# EAGLE design RAC-tracker (EAGLE 9.5.2)
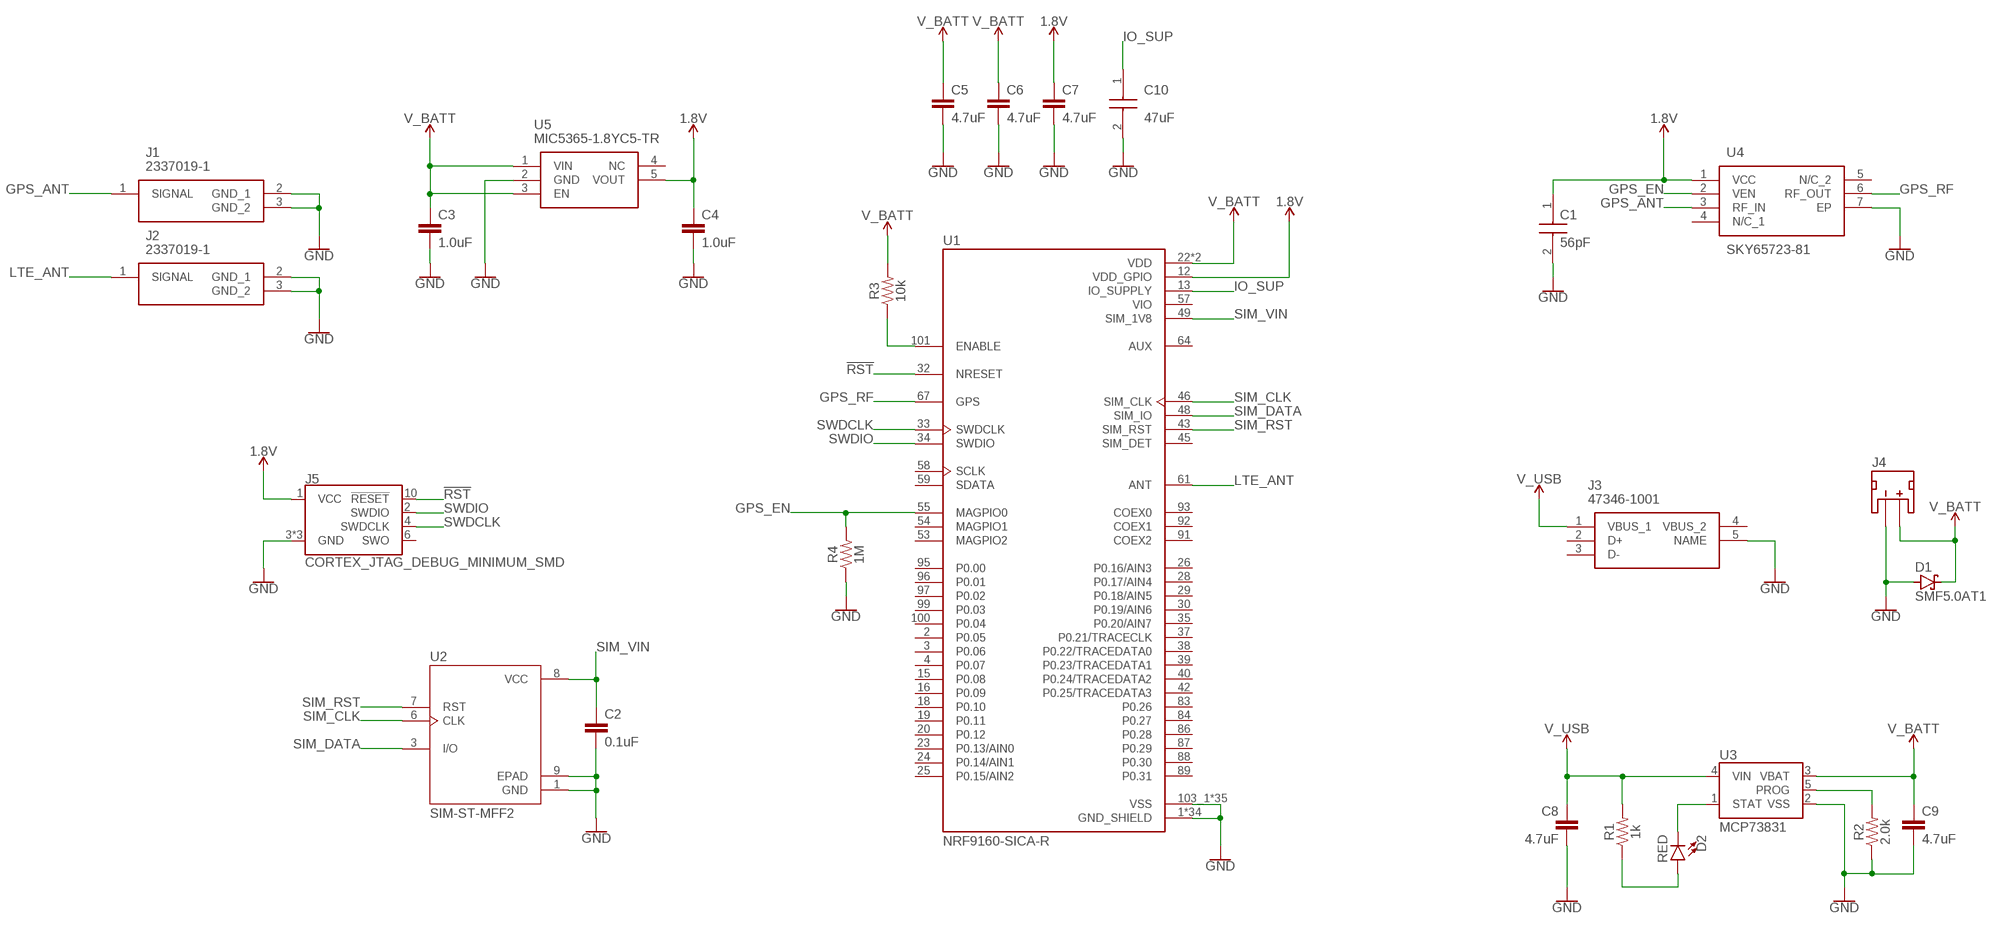
[diagram p0: schematic, sheet 1]

## Parts
C1  56pF  GRM1885C1H560JA01J  [CAPC1608X90N]
C2  0.1uF  0.1UF-0603-25V-(+80/-20%)  [0603]
C3  1.0uF  1.0UF-0603-16V-10%  [0603]
C4  1.0uF  1.0UF-0603-16V-10%  [0603]
C5  4.7uF  4.7UF0603  [0603]
C6  4.7uF  4.7UF0603  [0603]
C7  4.7uF  4.7UF0603  [0603]
C8  4.7uF  4.7UF0603  [0603]
C9  4.7uF  4.7UF0603  [0603]
C10  47uF  JMK212BBJ476MG-T  [CAPC2012X145N]
D1  SMF5.0AT1  [SOD123FL]
D2  RED  LED-RED0603  [LED-0603]
J1  2337019-1  [23370191]
J2  2337019-1  [23370191]
J3  47346-1001  [47346-0001]
J4  JST_2MM_MALE  [JST-2-SMD]
J5  CORTEX_JTAG_DEBUG_MINIMUM_SMD  [2X5-SMD-1.27MM]
R1  1k  1KOHM-0603-1/10W-1%  [0603]
R2  2.0k  2.0KOHM-0603-1/10W-5%  [0603]
R3  10k  10KOHM-0603-1/10W-1%  [0603]
R4  1M  1MOHM-0603-1/4W-5%  [0603]
U1  NRF9160-SICA-R  [NORDIC_NRF9160-SICA-R]
U2  SIM-ST-MFF2  [PSON127P500X600X82-9N]
U3  MCP73831  [SOT23-5]
U4  SKY65723-81  [SKY6572381]
U5  MIC5365-1.8YC5-TR  [SOT65P210X110-5N]

## Nets
1.8V: C1.1 C4.1 C7.1 J5.1(VCC) U1.12(VDD_GPIO) U4.1(VCC) U5.5(VOUT)
!RST: J5.10(!RESET) U1.32(NRESET)
EN: R3.1 U1.101(ENABLE)
GND: C1.2 C2.2 C3.2 C4.2 C5.2 C6.2 C7.2 C8.2 C9.2 C10.2 D1.A J1.2(GND_1) J1.3(GND_2) J2.2(GND_1) J2.3(GND_2) J3.5(NAME) J4.1(-) J5.3(GND) J5.5(GND) J5.9(GND) R2.1 R4.1 U1.1(GND_SHIELD) U1.5(GND_SHIELD) U1.9(GND_SHIELD) U1.14(GND_SHIELD) U1.17(GND_SHIELD) U1.21(GND_SHIELD) U1.27(GND_SHIELD) U1.31(GND_SHIELD) U1.36(GND_SHIELD) U1.41(GND_SHIELD) U1.44(GND_SHIELD) U1.47(GND_SHIELD) U1.50(GND_SHIELD) U1.52(GND_SHIELD) U1.56(GND_SHIELD) U1.60(GND_SHIELD) U1.62(GND_SHIELD) U1.63(GND_SHIELD) U1.65(GND_SHIELD) U1.66(GND_SHIELD) U1.72(GND_SHIELD) U1.74(GND_SHIELD) U1.75(GND_SHIELD) U1.76(GND_SHIELD) U1.77(GND_SHIELD) U1.78(GND_SHIELD) U1.79(GND_SHIELD) U1.80(GND_SHIELD) U1.81(GND_SHIELD) U1.82(GND_SHIELD) U1.85(GND_SHIELD) U1.90(GND_SHIELD) U1.94(GND_SHIELD) U1.98(GND_SHIELD) U1.103_1(VSS) U1.103_2(VSS) U1.103_3(VSS) U1.103_4(VSS) U1.103_5(VSS) U1.103_6(VSS) U1.103_7(VSS) U1.103_8(VSS) U1.103_9(VSS) U1.103_10(VSS) U1.103_11(VSS) U1.103_12(VSS) U1.103_13(VSS) U1.103_14(VSS) U1.103_15(VSS) U1.103_16(VSS) U1.103_17(VSS) U1.103_18(VSS) U1.103_19(VSS) U1.103_20(VSS) U1.103_21(VSS) U1.103_22(VSS) U1.103_23(VSS) U1.103_24(VSS) U1.103_25(VSS) U1.103_26(VSS) U1.103_27(VSS) U1.103_28(VSS) U1.103_29(VSS) U1.103_30(VSS) U1.103_31(VSS) U1.103_32(VSS) U1.103_33(VSS) U1.103_34(VSS) U1.103_35(VSS) U2.1(GND) U2.9(EPAD) U3.2(VSS) U4.7(EP) U5.2(GND)
GPS_ANT: J1.1(SIGNAL) U4.3(RF_IN)
GPS_EN: R4.2 U1.55(MAGPIO0) U4.2(VEN)
GPS_RF: U1.67(GPS) U4.6(RF_OUT)
IO_SUP: C10.1 U1.13(IO_SUPPLY)
LTE_ANT: J2.1(SIGNAL) U1.61(ANT)
PROG: R2.2 U3.5(PROG)
SIM_CLK: U1.46(SIM_CLK) U2.6(CLK)
SIM_DATA: U1.48(SIM_IO) U2.3(I/O)
SIM_RST: U1.43(SIM_RST) U2.7(RST)
SIM_VIN: C2.1 U1.49(SIM_1V8) U2.8(VCC)
STAT: D2.C U3.1(STAT)
STAT_AN: D2.A R1.1
SWDCLK: J5.4(SWDCLK) U1.33(SWDCLK)
SWDIO: J5.2(SWDIO) U1.34(SWDIO)
V_BATT: C3.1 C5.1 C6.1 C9.1 D1.C J4.2(+) R3.2 U1.22(VDD) U1.102(VDD) U3.3(VBAT) U5.1(VIN) U5.3(EN)
V_USB: C8.1 J3.1(VBUS_1) R1.2 U3.4(VIN)
Unconnected: J3.2(D+) J3.3(D-) J3.4(VBUS_2) J4.NC1(PAD1) J4.NC2(PAD2) J5.6(SWO) U1.2(P0.05) U1.3(P0.06) U1.4(P0.07) U1.15(P0.08) U1.16(P0.09) U1.18(P0.10) U1.19(P0.11) U1.20(P0.12) U1.23(P0.13/AIN0) U1.24(P0.14/AIN1) U1.25(P0.15/AIN2) U1.26(P0.16/AIN3) U1.28(P0.17/AIN4) U1.29(P0.18/AIN5) U1.30(P0.19/AIN6) U1.35(P0.20/AIN7) U1.37(P0.21/TRACECLK) U1.38(P0.22/TRACEDATA0) U1.39(P0.23/TRACEDATA1) U1.40(P0.24/TRACEDATA2) U1.42(P0.25/TRACEDATA3) U1.45(SIM_DET) U1.53(MAGPIO2) U1.54(MAGPIO1) U1.58(SCLK) U1.59(SDATA) U1.64(AUX) U1.83(P0.26) U1.84(P0.27) U1.86(P0.28) U1.87(P0.29) U1.88(P0.30) U1.89(P0.31) U1.91(COEX2) U1.92(COEX1) U1.93(COEX0) U1.95(P0.00) U1.96(P0.01) U1.97(P0.02) U1.99(P0.03) U1.100(P0.04) U4.4(N/C_1) U4.5(N/C_2) U5.4(NC)

## Power pins joined to a net without a drawn wire
VIO: U1.57(VIO)

## Library data of the parts
C1 = rocket-components:GRM1885C1H560JA01J: Multilayer Ceramic Capacitors MLCC - SMD/SMT 0603 56pF 50volts C0G 5% Source: Datasheet <https://componentsearchengine.com/Datasheets/1/GRM1885C1H560JA01J.pdf>; DESCRIPTION: Multilayer Ceramic Capacitors MLCC - SMD/SMT 0603 56pF 50volts C0G 5%; HEIGHT: 0.9mm; MANUFACTURER_NAME: Murata Electronics; MANUFACTURER_PART_NUMBER: GRM1885C1H560JA01J; MOUSER_PART_NUMBER: 81-GRM39C560J50J; MOUSER_PRICE-STOCK: https://www.mouser.com/Search/Refine.aspx?Keyword=81-GRM39C560J50J
C2 = SparkFun-Capacitors:0.1UF: 0.1µF ceramic capacitors A capacitor is a passive two-terminal electrical component used to store electrical energy temporarily in an electric field.; PROD_ID: CAP-00810
C3 C4 = SparkFun-Capacitors:1.0UF: 1µF ceramic capacitors A capacitor is a passive two-terminal electrical component used to store electrical energy temporarily in an electric field.; PROD_ID: CAP-00868
C5-C9 = SparkFun-Capacitors:4.7UF: 4.7µF ceramic capacitors A capacitor is a passive two-terminal electrical component used to store electrical energy temporarily in an electric field.; PROD_ID: CAP-08280
C10 = rocket-components:JMK212BBJ476MG-T: 0805 (2012M) 47uF MLCC 6.3V dc +/-20% SMD Source: Datasheet <https://componentsearchengine.com/Datasheets/1/JMK212BBJ476MG-T.pdf>; DESCRIPTION: 0805 (2012M) 47uF MLCC 6.3V dc +/-20% SMD; HEIGHT: 1.45mm; MANUFACTURER_NAME: TAIYO YUDEN; MANUFACTURER_PART_NUMBER: JMK212BBJ476MG-T; MOUSER_PART_NUMBER: 963-JMK212BBJ476MG-T; MOUSER_PRICE-STOCK: https://www.mouser.com/Search/Refine.aspx?Keyword=963-JMK212BBJ476MG-T
D1 = diode:SMF5.0AT1: 200 W Transient Voltage Suppressor Source: Data sheet <http://www.onsemi.com/pub_link/Collateral/SMF5.0AT1-D.PDF>
D2 = SparkFun-LED:LED-RED: Red SMD LED Used in manufacturing of most products at SparkFun Packages: 0603 - SMD 0603 package [Product Link] <http://docs.avagotech.com/docs/AV02-0551EN> 0603 SMART - SMD 0603 SMART package ( more efficient and expensive)[Product Link] <http://www.osram-os.com/Graphics/XPic2/00077099_0.pdf> 1206 - SMD1206 package [Product Link] <https://www.sparkfun.com/datasheets/DevTools/LilyPad/Q150OVS4.pdff> SparkFun Products: Pro Mini 328 -5V <https://www.sparkfun.com/products/821> RedBoard <https://www.sparkfun.com/products/12757> IOIO-OTG <https://www.sparkfun.com/products/13613>; PROD_ID: DIO-00819
J1 J2 = rocket-components:2337019-1: RF Connectors / Coaxial Connectors MicroCoax receptacle UMCC Gen 1 Source: Datasheet <https://componentsearchengine.com/Datasheets/1/2337019-1.pdf>; DESCRIPTION: RF Connectors / Coaxial Connectors MicroCoax receptacle UMCC Gen 1; HEIGHT: 1.4mm; MANUFACTURER_NAME: TE Connectivity; MANUFACTURER_PART_NUMBER: 2337019-1; MOUSER_PART_NUMBER: 571-2337019-1; MOUSER_PRICE-STOCK: https://www.mouser.com/Search/Refine.aspx?Keyword=571-2337019-1
J3 = rocket-components:47346-1001: MOLEX - 47346-1001 - MULTIPOLE CONNECTOR Source: Datasheet <https://componentsearchengine.com/Datasheets/1/47346-1001.pdf>; DESCRIPTION: MOLEX - 47346-1001 - MULTIPOLE CONNECTOR; HEIGHT: mm; MANUFACTURER_NAME: Molex; MANUFACTURER_PART_NUMBER: 47346-1001; MOUSER_PART_NUMBER: 538-47346-1001; MOUSER_PRICE-STOCK: https://www.mouser.com/Search/Refine.aspx?Keyword=538-47346-1001
J4 = SparkFun-Connectors:JST_2MM_MALE: JST 2MM MALE RA CONNECTOR Two pin, compact surface mount connector. Commonly used as a battery input connection point. We really like the solid locking feeling and high current rating on these small connectors. We use these all the time as battery connectors. Mates to single-cell LiPo batteries. Here is the connector we sell at SparkFun: JST Right Angle Connector - White <https://www.sparkfun.com/products/8612> (PRT-08612) Datasheet <http://www.sparkfun.com/datasheets/Prototyping/Connectors/JST-Horizontal.pdf> It was used on these SparkFun products: SparkFun MOSFET Power Controller <https://www.sparkfun.com/products/11214> (PRT-11214) SparkFun Battery Babysitter - LiPo Battery Manager <https://www.sparkfun.com/products/13777> (PRT-13777) And many, many others that required a lipo battery connection.; PROD_ID: CONN-11443; SF_ID: PRT-08612
J5 = SparkFun-Connectors:CORTEX_JTAG_DEBUG_MINIMUM: Cortex Debug Connector - 10 pin Supports JTAG debug, Serial Wire debug, and Serial Wire Viewer. PTH and SMD connector options available. General Connector Information <http://infocenter.arm.com/help/topic/com.arm.doc.faqs/attached/13634/cortex_debug_connectors.pdf> Products: PTH Connector <http://www.digikey.com/product-detail/en/cnc-tech/3220-10-0100-00/1175-1627-ND/3883661> -via Digi-Key SparkFun PSoc <https://www.sparkfun.com/products/13229> SparkFun T <https://www.sparkfun.com/products/13810>; PROD_ID: CONN-14503
R1 = SparkFun-Resistors:1KOHM: 1kΩ resistor A resistor is a passive two-terminal electrical component that implements electrical resistance as a circuit element. Resistors act to reduce current flow, and, at the same time, act to lower voltage levels within circuits. - Wikipedia; PROD_ID: RES-07856
R2 = SparkFun-Resistors:2.0KOHM: 2kΩ resistor A resistor is a passive two-terminal electrical component that implements electrical resistance as a circuit element. Resistors act to reduce current flow, and, at the same time, act to lower voltage levels within circuits. - Wikipedia; PROD_ID: RES-08296
R3 = SparkFun-Resistors:10KOHM: 10kΩ resistor A resistor is a passive two-terminal electrical component that implements electrical resistance as a circuit element. Resistors act to reduce current flow, and, at the same time, act to lower voltage levels within circuits. - Wikipedia; PROD_ID: RES-00824
R4 = SparkFun-Resistors:1MOHM: 1MΩ resistor A resistor is a passive two-terminal electrical component that implements electrical resistance as a circuit element. Resistors act to reduce current flow, and, at the same time, act to lower voltage levels within circuits. - Wikipedia; PROD_ID: RES-07868
U1 = rocket-components:NRF9160-SICA-R: NRF9160-SICA-R; AVAILABILITY: Unavailable; DESCRIPTION: IC RF TxRx + MCU Cellular GPS 700MHz ~ 2.2GHz 161-TFLGA Module; MF: Nordic Semiconductor; MP: NRF9160-SICA-R; PACKAGE: Module Nordic Semiconductor; PRICE: None
U2 = rocket-components:SIM-ST-MFF2: GLOBAL IOT EMBEDDED SIM CHIP; DESCRIPTION: GLOBAL IOT EMBEDDED SIM CHIP; DIGI-KEY_PART_NUMBER: 1887-1002-1-ND; DIGI-KEY_PURCHASE_URL: https://www.digikey.com/product-detail/en/hologram-inc/SIM-ST-MFF2/1887-1002-1-ND/9489900?utm_source=snapeda&utm_medium=aggregator&utm_campaign=symbol; MF: Hologram, Inc.; MP: SIM-ST-MFF2; PACKAGE: None
U3 = SparkFun-IC-Power:MCP73831: MCP73831T Li-Ion, Li-Pol Controller Miniature single cell, fully integrated Li-Ion, Li-polymer charge management controller Datasheet <http://ww1.microchip.com/downloads/en/DeviceDoc/20001984g.pdf> SparkFun Products: SparkFun ESP32 Thing <https://www.sparkfun.com/products/13907> SparkFun 9DoF Razor IMU M0 <https://www.sparkfun.com/products/14001>; PROD_ID: IC-09995
U4 = rocket-components:SKY65723-81: RF Front End GPS/GNSS/BDS Pre-Filter Source: Datasheet <https://componentsearchengine.com/Datasheets/1/SKY65723-81.pdf>; DESCRIPTION: RF Front End GPS/GNSS/BDS Pre-Filter; HEIGHT: 0.8mm; MANUFACTURER_NAME: Skyworks; MANUFACTURER_PART_NUMBER: SKY65723-81; MOUSER_PART_NUMBER: 873-SKY65723-81; MOUSER_PRICE-STOCK: https://www.mouser.com/Search/Refine.aspx?Keyword=873-SKY65723-81
U5 = rocket-components:MIC5365-1.8YC5-TR: IC REG LINEAR 1.8V 150MA SC70-5 Source: Datasheet <https://www.mouser.com/datasheet/2/268/mic5365-779177.pdf>; DESCRIPTION: IC REG LINEAR 1.8V 150MA SC70-5; HEIGHT: 1.1mm; MANUFACTURER_NAME: Microchip; MANUFACTURER_PART_NUMBER: MIC5365-1.8YC5-TR; MOUSER_PART_NUMBER: 998-MIC5365-1.8YC5TR

## Board
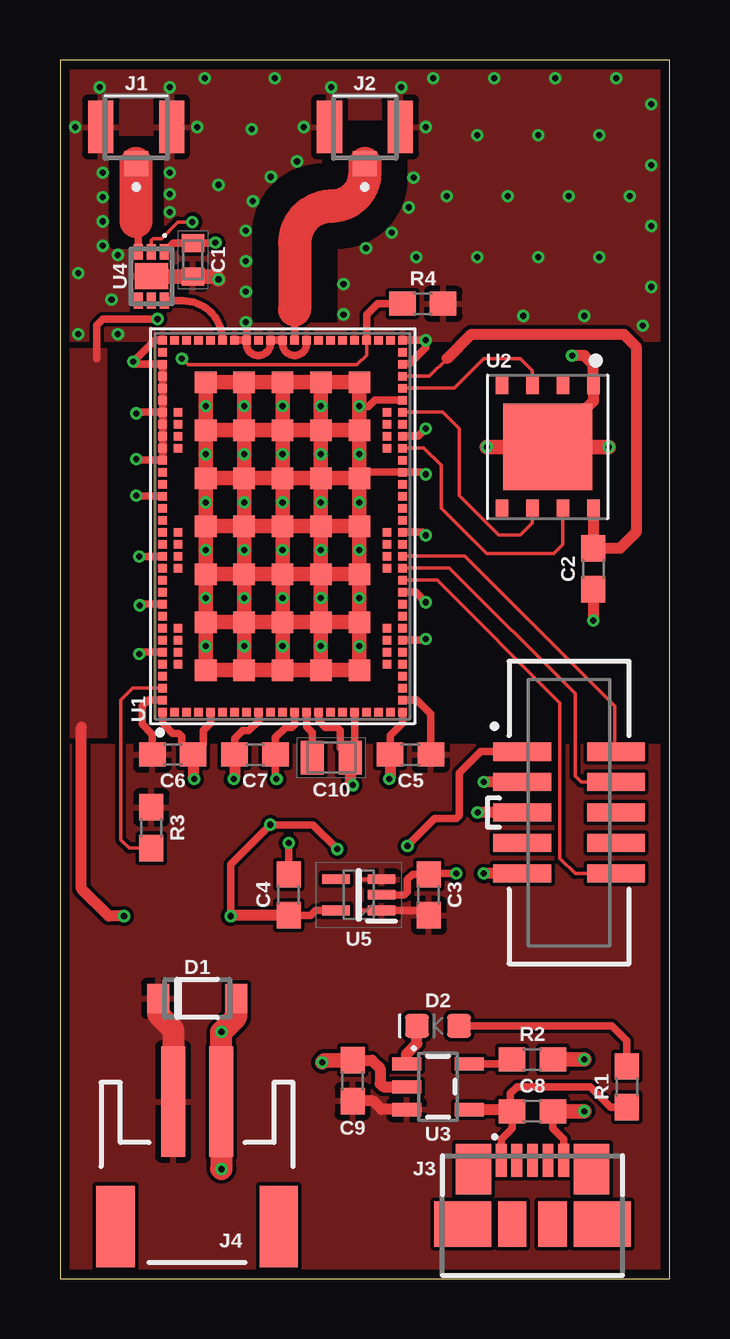
[diagram p1: board, top side]
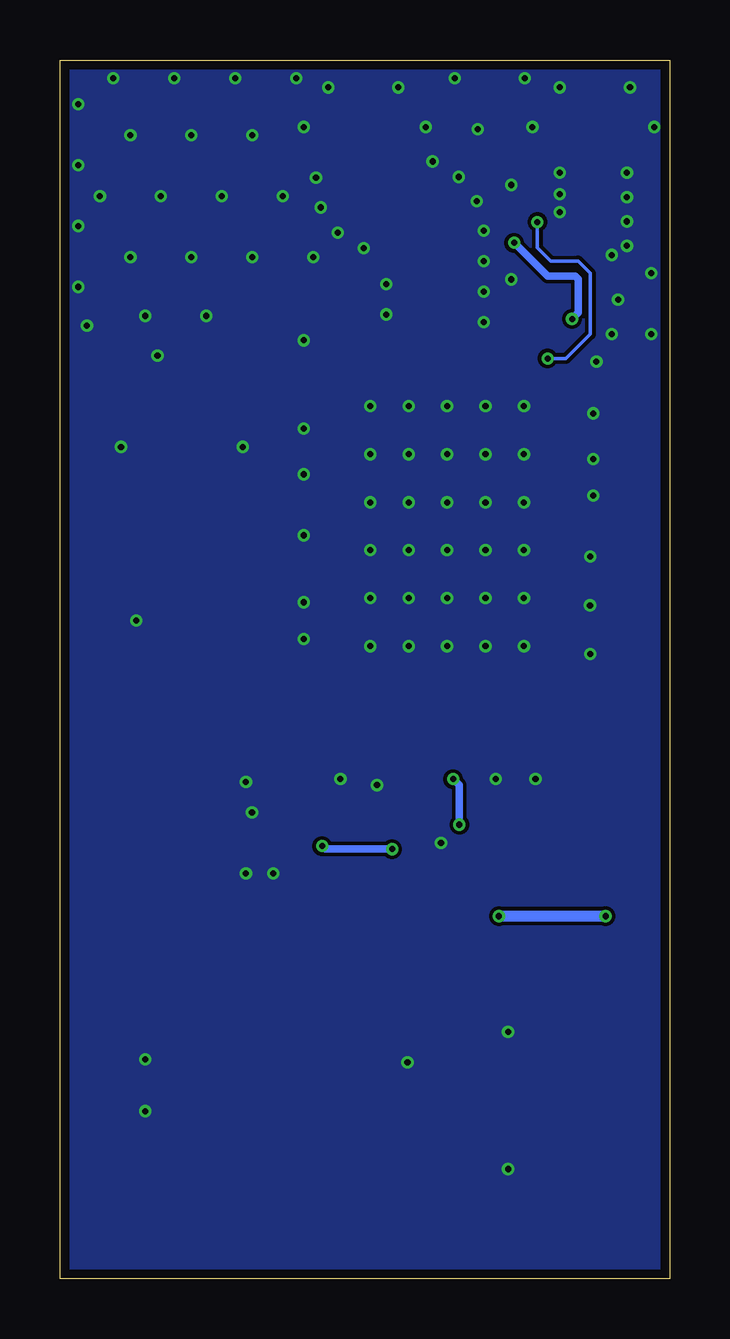
[diagram p2: board, bottom side, seen from below]

Size 25.4 x 50.8 mm. Coordinates in mm from the lower left corner, seen from the top.
Outline: 0,0 25.4,0 25.4,50.8 0,50.8 0,0
Copper layers (1*16): Top 0.035559375mm / dielectric 1.6mm / Bottom 0.035559375mm
Design rules "oshpark-2layer": minimum track width 6mil, minimum drill 10mil, track to track 6mil, track to pad 6mil, pad to pad 6mil, via to via 6mil, smd to smd 6mil, copper to edge 15mil, drill to drill 6mil, minimum pad ring 5mil, minimum via ring 5mil, stop-mask expansion 2.5mil, vias tented up to drill 0mil, thermal gap 10mil
tRestrict: area 2,42.9 to 4.3,47.6; area 8,39.9 to 14.5,48.3

### Footprints (pad centres in the part's own frame; a part is rotated, then mirrored left to right if it is on the bottom)
CAPC1608X90N = smd 0.75 x 0.94: 1 -0.7,0; 2 0.7,0
0603 = smd 1.1 x 1: 1 -0.85,0; 2 0.85,0
CAPC2012X145N = smd 0.96 x 1.39: 1 -0.79,0; 2 0.79,0
SOD123FL = smd 0.91 x 1.22: A 1.625,0; C -1.625,0
LED-0603 = smd 1 x 1: A -0.877,0; C 0.877,0
23370191 = smd 1 x 1.05: 1 0,-1.525 | smd 1.05 x 2.2: 2 -1.475,0; 3 1.475,0
47346-0001 = smd 0.45 x 1.38: 1 1.3,-4.81; 2 0.65,-4.81; 3 0,-4.81; 4 -0.65,-4.81; 5 -1.3,-4.81 | smd 1.475 x 2.1: 6 -2.453,-4.45; 7 2.453,-4.45 | smd 1.175 x 1.9: 8 0.838,-2.15; 9 -0.838,-2.15 | smd 2.375 x 1.9: 10 2.913,-2.15; 11 -2.913,-2.15
JST-2-SMD = smd 1 x 4.6: 1 -1,-3.7; 2 1,-3.7 | smd 1.6 x 3.4: NC1 -3.4,1.5; NC2 3.4,1.5
2X5-SMD-1.27MM = smd 0.76 x 2.4: 1 2.54,1.95; 2 2.54,-1.95; 3 1.27,1.95; 4 1.27,-1.95; 5 0,1.95; 6 0,-1.95; 7 -1.27,1.95; 8 -1.27,-1.95; 9 -2.54,1.95; 10 -2.54,-1.95
NORDIC_NRF9160-SICA-R = smd 0.35 x 0.35: 1 -7.75,5; 2 -7.75,4.5; 3 -7.75,4; 4 -7.75,3.5; 5 -7.75,3; 6 -7.75,2.5; 7 -7.75,2; 8 -7.75,1.5; 9 -7.75,1; 10 -7.75,0.5; 11 -7.75,0; 12 -7.75,-0.5; 13 -7.75,-1; 14 -7.75,-1.5; 15 -7.75,-2; 16 -7.75,-2.5; 17 -7.75,-3; 18 -7.75,-3.5; 19 -7.75,-4; 20 -7.75,-4.5; 21 -7.75,-5; 22 -7.25,-5; 23 -6.75,-5; 24 -6.25,-5; 25 -5.75,-5; 26 -5.25,-5; 27 -4.75,-5; 28 -4.25,-5; 29 -3.75,-5; 30 -3.25,-5; 31 -2.75,-5; 32 -2.25,-5; 33 -1.75,-5; 34 -1.25,-5; 35 -0.75,-5; 36 -0.25,-5; 37 0.25,-5; 38 0.75,-5; 39 1.25,-5; 40 1.75,-5; 41 2.25,-5; 42 2.75,-5; 43 3.25,-5; 44 3.75,-5; 45 4.25,-5; 46 4.75,-5; 47 5.25,-5; 48 5.75,-5; 49 6.25,-5; 50 6.75,-5; 51 7.25,-5; 52 7.75,-5; 53 7.75,-4.5; 54 7.75,-4; 55 7.75,-3.5; 56 7.75,-3; 57 7.75,-2.5; 58 7.75,-2; 59 7.75,-1.5; 60 7.75,-1; 61 7.75,-0.5; 62 7.75,0; 63 7.75,0.5; 64 7.75,1; 65 7.75,1.5; 66 7.75,2; 67 7.75,2.5; 68 7.75,3; 69 7.75,3.5; 70 7.75,4; 71 7.75,4.5; 72 7.75,5; 73 7.25,5; 74 6.75,5; 75 6.25,5; 76 5.75,5; 77 5.25,5; 78 4.75,5; 79 4.25,5; 80 3.75,5; 81 3.25,5; 82 2.75,5; 83 2.25,5; 84 1.75,5; 85 1.25,5; 86 0.75,5; 87 0.25,5; 88 -0.25,5; 89 -0.75,5; 90 -1.25,5; 91 -1.75,5; 92 -2.25,5; 93 -2.75,5; 94 -3.25,5; 95 -3.75,5; 96 -4.25,5; 97 -4.75,5; 98 -5.25,5; 99 -5.75,5; 100 -6.25,5; 101 -6.75,5; 102 -7.25,5; 104 -5.75,-4.35; 105 -5.25,-4.35; 106 -4.75,-4.35; 107 -4.25,-4.35; 108 -1.75,-4.35; 109 -1.25,-4.35; 110 -0.75,-4.35; 111 -0.25,-4.35; 112 3.25,-4.35; 113 3.75,-4.35; 114 4.25,-4.35; 115 4.75,-4.35; 116 4.75,4.35; 117 4.25,4.35; 118 3.75,4.35; 119 3.25,4.35; 120 -0.25,4.35; 121 -0.75,4.35; 122 -1.25,4.35; 123 -1.75,4.35; 124 -4.25,4.35; 125 -4.75,4.35; 126 -5.25,4.35; 127 -5.75,4.35 | smd 0.9 x 0.9: 103_1 -6,3.2; 103_2 -4,3.2; 103_3 -2,3.2; 103_4 0,3.2; 103_5 2,3.2; 103_6 4,3.2; 103_7 6,3.2; 103_8 -6,1.6; 103_9 -4,1.6; 103_10 -2,1.6; 103_11 0,1.6; 103_12 2,1.6; 103_13 4,1.6; 103_14 6,1.6; 103_15 -6,0; 103_16 -4,0; 103_17 -2,0; 103_18 0,0; 103_19 2,0; 103_20 4,0; 103_21 6,0; 103_22 -6,-1.6; 103_23 -4,-1.6; 103_24 -2,-1.6; 103_25 0,-1.6; 103_26 2,-1.6; 103_27 4,-1.6; 103_28 6,-1.6; 103_29 -6,-3.2; 103_30 -4,-3.2; 103_31 -2,-3.2; 103_32 0,-3.2; 103_33 2,-3.2; 103_34 4,-3.2; 103_35 6,-3.2
PSON127P500X600X82-9N = smd 0.71 x 0.51: 1 -2.55,1.905; 2 -2.55,0.635; 3 -2.55,-0.635; 4 -2.55,-1.905; 5 2.55,-1.905; 6 2.55,-0.635; 7 2.55,0.635; 8 2.55,1.905 | smd 3.6 x 3.7: 9 0,0
SOT23-5 = smd 0.55 x 1.2: 1 -0.95,-1.3; 2 0,-1.3; 3 0.95,-1.3; 4 0.95,1.3; 5 -0.95,1.3
SKY6572381 = smd 0.375 x 0.66: 1 -0.54,-1.02; 2 0,-1.02; 3 0.54,-1.02; 4 0.54,1.02; 5 0,1.02; 6 -0.54,1.02 | smd 1.4 x 1.08: 7 0,0
SOT65P210X110-5N = smd 1.15 x 0.4: 1 -0.95,0.65; 2 -0.95,0; 3 -0.95,-0.65; 4 0.95,-0.65; 5 0.95,0.65

### Placement (x,y rotation side)
C1  5.54,42.47 270 top
C2  22.23,29.59 270 top
C3  15.37,16 90 top
C4  9.53,16 90 top
C5  14.61,21.84 180 top
C6  4.7,21.84 0 top
C7  8.13,21.84 180 top
C8  19.68,6.99 0 top
C9  12.19,8.26 90 top
C10  11.3,21.72 0 top
D1  5.71,11.68 0 top
D2  15.75,10.54 180 top
J1  3.17,48.01 0 top
J2  12.7,48.01 0 top
J3  19.68,0.13 180 top
J4  5.71,3.68 180 top
J5  21.21,19.43 90 top
R1  23.62,8 270 top
R2  19.68,9.14 180 top
R3  3.81,18.8 90 top
R4  15.11,40.64 180 top
U1  9.27,31.37 90 top
U2  20.32,34.67 270 top
U3  15.75,8 270 top
U4  3.81,41.78 180 top
U5  12.45,16 180 top

### Tracks (layer width: path | path; a pad name or v marks a point on that pad's centre or on a via)
1.8V  (via drill 0.25)
  Top 0.305: U5.5 10.65,15.35 10.45,15.15 C4.1 | U1.12 9.77,23.11 9.65,22.99 9.4,22.99 8.98,22.57 C7.1 8.98,20.87 v9.02,20.83 | U4.1 4.72,43.17 C1.1 6.47,43.17 v6.48,43.18 | v7.11,15.11 7.11,17.27 v8.76,18.92 10.54,18.92 v11.56,17.91 | v14.48,18.03 15.62,19.18 16.51,19.18 16.64,19.3 16.64,21.08 17.53,21.97 J5.1 | v4.06,40.01 1.78,40.01 1.52,39.75 1.52,38.35
  Top 0.457: C4.1 7.15,15.15 v7.11,15.11 | v2.67,15.11 2.03,15.11 0.89,16.26 0.89,22.99
  Bottom 0.305: v11.56,17.91 14.35,17.91 v14.48,18.03 | v8.76,18.92 8.76,20.57 v9.02,20.83 | v6.48,43.18 5.08,41.78 3.94,41.78 3.81,41.66 3.81,40.26 v4.06,40.01
  Bottom 0.457: v7.11,15.11 v2.67,15.11
  pour Top: 0,38.73 0,22.61 1.91,22.61 1.91,38.73
!RST
  Top 0.152: U1.32 15.71,29.12 20.83,24 20.83,17.53 21.46,16.89 J5.10
EN
  Top 0.152: R3.1 2.88,17.95 2.54,18.29 2.54,24.13 3.03,24.62 U1.101
GND  (via drill 0.25)
  Top 0.305: U1.90 4.25,30.1 v3.3,30.1 | U1.94 3.37,28.12 v3.32,28.07 | U1.98 3.39,26.12 v3.3,26.04 | U1.27 15.19,26.62 v15.24,26.67 | U1.36 15.11,31.12 v15.24,30.99 | U1.103_33 12.72,33.62 U1.41 15.15,33.62 v15.24,33.53 | U1.44 14.93,35.12 v15.24,35.43 | U1.47 13.12,36.62 12.85,36.35 12.47,36.35 | U1.52 v15.24,39.12 15.24,38.81 14.57,38.14 14.29,38.14 U1.50 | U5.2 14.35,16 14.48,16.13 14.48,16.64 14.69,16.85 C3.2 15.41,16.89 v16.51,16.89 | C4.2 v9.53,18.16 | C8.2 20.54,6.26 20.98,5.81 J3.5 | U1.31 14.81,28.62 v15.24,28.19 | U1.1 4.27,23.16 4.7,22.73 4.95,22.73 5.08,22.61 5.08,22.31 C6.2 5.97,22.26 5.97,22.86 6.27,23.16 U1.5 | C7.2 7.28,22.52 7.62,22.86 7.87,22.86 8.27,23.26 U1.9 | U1.14 10.77,23.27 11.05,22.99 11.56,22.99 11.68,22.86 11.68,22.13 C10.2 12.27,21.89 U1.17 | U1.21 14.27,23.16 13.76,22.64 C5.2 | U1.60 10.27,38.97 arc-90 9.78,38.48 arc-90 9.27,38.99 U1.62 U1.63 8.77,39 arc-90 8.26,38.48 arc-90 7.77,38.97 U1.65 | U1.85 3.19,32.62 v3.17,32.64 | v3.17,34.16 3.22,34.12 U1.82 U1.81 U1.80 U1.79 U1.78 | U1.78 3.23,36.12 v3.17,36.07 | U1.78 U1.77 U1.76 U1.75 U1.74 3.16,38.12 v3.05,38.23 3.94,39.12 U1.72 | U1.66 U1.65 | v7.75,39.88 7.77,39.88 U1.65
  Top 0.457: C9.2 12.99,9.11 13.34,8.76 13.34,8.13 13.46,8 U3.2 | v21.34,38.48 21.84,38.48 22.23,38.1 U2.1 22.23,36.58 U2.9 | C2.2 v22.23,27.43 | C6.2 5.55,20.87 v5.59,20.83 | C7.2 7.28,20.87 v7.24,20.83 | C10.2 12.09,20.67 v12.19,20.57 | C5.2 13.76,20.87 v13.72,20.83 | J5.9 v17.65,16.89 | J5.5 v17.4,19.43 | J5.3 v17.65,20.7
  Top 0.61: v6.07,36.37 U1.103_7 U1.103_14 | v6.07,36.37 | v6.07,36.37 U1.103_6 | U1.103_6 v6.07,34.37 | v6.07,34.37 | v6.07,34.37 U1.103_5 | U1.103_5 v6.07,32.36 U1.103_4 | U1.103_5 | v6.07,30.38 U1.103_4 | U1.103_4 | U1.103_3 v6.07,30.38 | v6.07,30.38 | U1.103_3 v6.07,28.37 | v6.07,28.37 | U1.103_2 v6.07,28.37 | U1.103_2 v6.07,26.37 | v6.07,26.37 v6.07,26.36 | v6.07,26.37 U1.103_1 U1.103_8 | U1.103_8 | U1.103_8 v7.67,26.36 U1.103_9 | U1.103_9 | U1.103_9 v7.67,28.37 | v7.67,28.37 | v7.67,28.37 U1.103_10 | U1.103_10 | U1.103_10 | U1.103_10 v7.67,30.38 U1.103_11 | U1.103_11 | U1.103_11 v7.67,32.36 U1.103_12 | U1.103_12 v7.67,34.37 | v7.67,34.37 | v7.67,34.37 U1.103_13 | U1.103_13 | U1.103_13 | U1.103_13 v7.67,36.37 U1.103_14 | U1.103_14 | U1.103_15 v9.27,26.36 U1.103_16 | U1.103_16 v9.27,28.37 U1.103_17 | U1.103_17 v9.27,30.38 U1.103_18 | U1.103_18 v9.27,32.36 U1.103_19 | U1.103_19 v9.27,34.37 U1.103_20 | U1.103_20 v9.27,36.37 U1.103_21 | U1.103_22 10.87,26.34 v10.87,26.36 10.87,26.39 U1.103_23 | U1.103_23 10.87,28.35 v10.87,28.37 10.87,28.4 U1.103_24 | U1.103_24 10.87,30.35 v10.87,30.38 10.87,30.4 U1.103_25 | U1.103_25 10.87,32.33 v10.87,32.36 10.87,32.38 U1.103_26 | U1.103_26 10.87,34.34 v10.87,34.37 10.87,34.39 U1.103_27 | U1.103_27 10.87,36.35 v10.87,36.37 10.87,36.4 U1.103_28 | U1.103_30 12.47,26.39 v12.47,26.36 12.47,26.34 U1.103_29 U1.103_22 | U1.103_30 12.47,28.35 v12.47,28.37 12.47,28.4 U1.103_31 | U1.103_31 12.47,30.35 v12.47,30.38 12.47,30.4 U1.103_32 | U1.103_32 12.47,32.33 v12.47,32.36 12.47,32.38 U1.103_33 | U1.103_33 12.47,34.34 v12.47,34.37 12.47,34.39 U1.103_34 | U1.103_34 12.47,36.35 v12.47,36.37 12.47,36.4 U1.103_35 U1.103_28 | U1.103_14 U1.103_21
  Top 0.61: U1.103_21 U1.103_28 | U1.103_6 U1.103_13 | U1.103_13 | U1.103_13 U1.103_20 | U1.103_20 U1.103_27 | U1.103_27 U1.103_34 | U1.103_5 U1.103_12 | U1.103_12 U1.103_19 | U1.103_19 U1.103_26 | U1.103_26 U1.103_33 | U1.103_4 U1.103_11 | U1.103_11 U1.103_18 | U1.103_18 U1.103_25 | U1.103_25 U1.103_32 | U1.103_3 U1.103_10 | U1.103_10 | U1.103_10 U1.103_17 | U1.103_17 U1.103_24 | U1.103_24 U1.103_31 | U1.103_2 | U1.103_2 U1.103_9 | U1.103_9 U1.103_16 | U1.103_16 U1.103_23 | U1.103_23 U1.103_30 | U1.103_8 U1.103_15 | U1.103_15 U1.103_22 | C8.2 v21.84,6.99 | R2.1 v21.84,9.14 | C9.2 11.01,9.11 v10.92,9.02 | U1.103_12 | v22.86,34.67 U2.9 v17.78,34.67 | U4.7 3.82,41.77 C1.2 6.49,41.77 v6.6,41.66
  Top 0.914: D1.A 7.34,10.9 v6.73,10.29 6.71,10.27 J4.1 6.71,4.59 v6.73,4.57
  other vias: 9.88,46.57 8.79,45.93 8.04,44.91 7.74,43.69 7.75,42.42 7.75,41.15 11.81,40.19 11.81,41.46 12.75,42.95 13.83,43.61 14.53,44.65 14.73,45.9 1.78,46.1 1.78,45.09 1.78,44.07 1.78,43.05 2.41,42.67 4.57,46.1 4.57,45.21 4.57,44.45 2.41,39.37 0.76,39.37 0.76,41.91 19.3,40.13 21.84,40.13 24.28,39.73 24.64,41.34 24.64,43.88 24.64,46.42 24.64,48.96 23.18,50.04 20.64,50.04 18.1,50.04 15.56,50.04 8.95,50.04 6.03,50.04 2.15,40.81 7.99,47.92 14.85,42.58 16.12,45.12 17.39,42.58 18.66,45.12 17.39,47.66 19.93,42.58 21.2,45.12 19.93,47.66 22.47,42.58 23.74,45.12 22.47,47.66 6.6,45.59 0.64,48.01 1.65,49.66 4.57,49.66 5.71,48.01 10.16,48.01 11.3,49.66 14.22,49.66 15.24,48.01
  pour Top: 11.81,39.12 25.4,39.12 25.4,50.8 0,50.8 0,39.12 7.75,39.12
  pour Bottom: 0,0 0,50.8 25.4,50.8 25.4,0
GPS_ANT
  Top 0.305: U4.3 3.27,43.97 arc90 3.17,44.07
  Top 1.372: 3.17,44.07 J1.1
GPS_EN  (via drill 0.25)
  Top 0.152: U4.2 3.81,43.28 3.89,43.36 4.24,43.36 4.52,43.64 4.52,43.66 4.9,44.04 v5.51,44.04 | U1.55 12.77,38.5 12.37,38.1 5.33,38.1 v5.08,38.35
  Top 0.305: R4.2 13.23,40.64 12.77,40.18 U1.55
  Bottom 0.152: v5.51,44.04 5.51,42.98 4.95,42.42 3.81,42.42 3.3,41.91 3.3,39.37 4.32,38.35 v5.08,38.35
GPS_RF
  Top 0.305: U1.67 arc90 5.13,40.76 U4.6
IO_SUP
  Top 0.305: U1.13 10.27,23 10.51,22.76 C10.1
LTE_ANT
  Top 0.305: U1.61 9.77,40.38 arc-90 9.78,40.39
  Top 1.372: 9.78,40.39 9.78,43.18 arc-90 11.3,44.7 11.3,44.7 arc90 12.7,46.1 J2.1
PROG
  Top 0.305: U3.5 18.64,8.95 R2.2
SIM_CLK
  Top 0.152: U1.46 15.95,36.12 16.64,35.43 16.64,32.64 18.29,30.99 19.18,30.99 19.68,31.5 U2.6
SIM_DATA
  Top 0.152: U1.48 16.42,37.12 17.65,38.35 19.18,38.35 19.68,37.85 U2.3
SIM_RST
  Top 0.152: U1.43 15.16,34.62 15.88,33.91 15.88,32.13 17.78,30.23 20.57,30.23 20.95,30.61 U2.7
SIM_VIN
  Top 0.152: U1.49 15.39,37.62 16.13,38.35
  Top 0.457: U2.8 C2.1 23.33,30.44 24,31.11 24,38.86 23.5,39.37 17.14,39.37 16.13,38.35
STAT
  Top 0.457: U3.1 14.45,9.37 14.87,9.79 D2.C
STAT_AN
  Top 0.305: D2.A 22.99,10.54 23.62,9.91 R1.1
SWDCLK
  Top 0.152: J5.4 21.72,20.7 21.46,20.95 21.46,24.38 16.23,29.62 U1.33
SWDIO
  Top 0.152: J5.2 23.11,22.02 23.11,23.88 16.87,30.12 U1.34
V_BATT
  Top 0.152: U5.1 12.59,15.35 12.45,15.49 12.45,16.51 12.59,16.65 U5.3
  Top 0.305: U5.1 15.17,15.35 C3.1 | C6.1 3.85,22.69 3.43,23.11 3.43,23.88 3.67,24.12 U1.102 | U1.22 14.87,24.12 15.46,23.53 C5.1
  Top 0.457: U3.3 13.4,7.05 13.04,7.41 C9.1
  Top 0.914: D1.C 4.09,11.02 4.71,10.4 J4.2
  pour Top (isolate 0.001): 0,0 0,22.23 25.4,22.23 25.4,0
V_USB
  Top 0.305: C8.1 18.84,6.26 18.39,5.81 J3.1 | R1.2 22.95,7.15 22.1,8 19.05,8 18.77,7.72 18.77,7.05
  Top 0.457: U3.4 18.77,7.05 C8.1